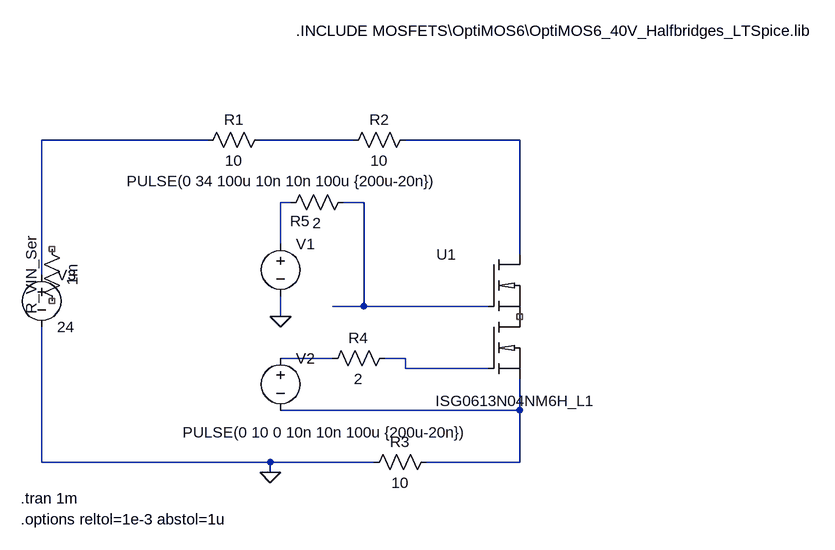
[diagram p0: schematic FETTest.asc]
FETTest.asc, the LTspice schematic file:
Version 4.1
SHEET 1 912 680
WIRE -64 -64 -320 -64
WIRE 160 -64 16 -64
WIRE 416 -64 240 -64
WIRE 64 32 48 32
WIRE 176 32 144 32
WIRE 48 96 48 32
WIRE 416 112 416 -64
WIRE -320 144 -320 -64
WIRE 176 192 176 32
WIRE 176 192 128 192
WIRE 368 192 176 192
WIRE 48 208 48 176
WIRE 128 272 48 272
WIRE 240 272 208 272
WIRE 240 288 240 272
WIRE 368 288 240 288
WIRE 416 352 416 304
WIRE 416 352 48 352
WIRE -320 432 -320 224
WIRE 32 432 -320 432
WIRE 192 432 32 432
WIRE 416 432 416 352
WIRE 416 432 272 432
WIRE 32 448 32 432
FLAG 32 448 0
FLAG 48 208 0
SYMBOL voltage 48 80 R0
WINDOW 3 -237 -81 Left 2
WINDOW 123 0 0 Left 0
WINDOW 39 0 0 Left 0
SYMATTR InstName V1
SYMATTR Value PULSE(0 34 100u 10n 10n 100u {200u-20n})
SYMBOL voltage 48 256 R0
WINDOW 3 -151 130 Left 2
WINDOW 123 0 0 Left 0
WINDOW 39 0 0 Left 0
SYMATTR InstName V2
SYMATTR Value PULSE(0 10 0 10n 10n 100u {200u-20n})
SYMBOL MOSFETs\\OptiMOS6\\Halfbridge_NMOS 368 208 R0
SYMATTR InstName U1
SYMATTR SpiceModel ISG0613N04NM6H_L1
SYMBOL voltage -320 128 R0
WINDOW 123 0 0 Left 0
WINDOW 39 0 0 Left 0
SYMATTR InstName V3
SYMATTR Value 24
SYMBOL res 32 -80 R90
WINDOW 0 0 56 VBottom 2
WINDOW 3 32 56 VTop 2
SYMATTR InstName R1
SYMATTR Value 10
SYMBOL res 256 -80 R90
WINDOW 0 0 56 VBottom 2
WINDOW 3 32 56 VTop 2
SYMATTR InstName R2
SYMATTR Value 10
SYMBOL res 288 416 R90
WINDOW 0 0 56 VBottom 2
WINDOW 3 32 56 VTop 2
SYMATTR InstName R3
SYMATTR Value 10
SYMBOL res 224 256 R90
WINDOW 0 0 56 VBottom 2
WINDOW 3 32 56 VTop 2
SYMATTR InstName R4
SYMATTR Value 2
SYMBOL res 160 16 R90
WINDOW 0 60 82 VBottom 2
WINDOW 3 32 56 VTop 2
SYMATTR InstName R5
SYMATTR Value 2
TEXT -352 488 Left 2 !.tran 1m
TEXT 72 -232 Left 2 !.INCLUDE MOSFETS\\OptiMOS6\\OptiMOS6_40V_Halfbridges_LTSpice.lib
SYMBOL res -320 88 R0
WINDOW 0 0 56 VBottom 2
WINDOW 3 32 56 VTop 2
SYMATTR InstName R_VIN_Ser
SYMATTR Value 1m
TEXT -352 520 Left 2 !.options reltol=1e-3 abstol=1u

The netlist it stands for:
* FETTest.asc
V1 N004 0 PULSE(0 34 100u 10n 10n 100u {200u-20n})
V2 N006 N008 PULSE(0 10 0 10n 10n 100u {200u-20n})
X§U1 N003 NC_01 N008 N005 N007 ISG0613N04NM6H_L1  ; pins VIN VSW GND GATEH GATEL
V3 N001 0 24
R1 N002 N001 10
R2 N003 N002 10
R3 N008 0 10
R4 N007 N006 2
R5 N005 N004 2
R_VIN_Ser NC_02 NC_03 1m
.tran 1m
.INCLUDE MOSFETS\OptiMOS6\OptiMOS6_40V_Halfbridges_LTSpice.lib
.options reltol=1e-3 abstol=1u
.backanno
.end